# Altium schematic sheet Main.SchDoc
size A4; Organization: HTL Hollabrunn; Address1: Abteilung Elektronik; Address2: Anton Ehrenfried-Straße 10; Address3: 2020 Hollabrunn; SheetNumber: 1; SheetTotal: 1; SPICEModelCacheOAIEALSM: <root> / <DocumentId>OAIEALSM</DocumentId> / <CacheFrame Number="0"> / <Model Name="cap" Kind="MDL"> / <Text>*Default semiconductor capacitor / .MODEL CAP C()</Text> / </Model> / </CacheFrame> / </root>
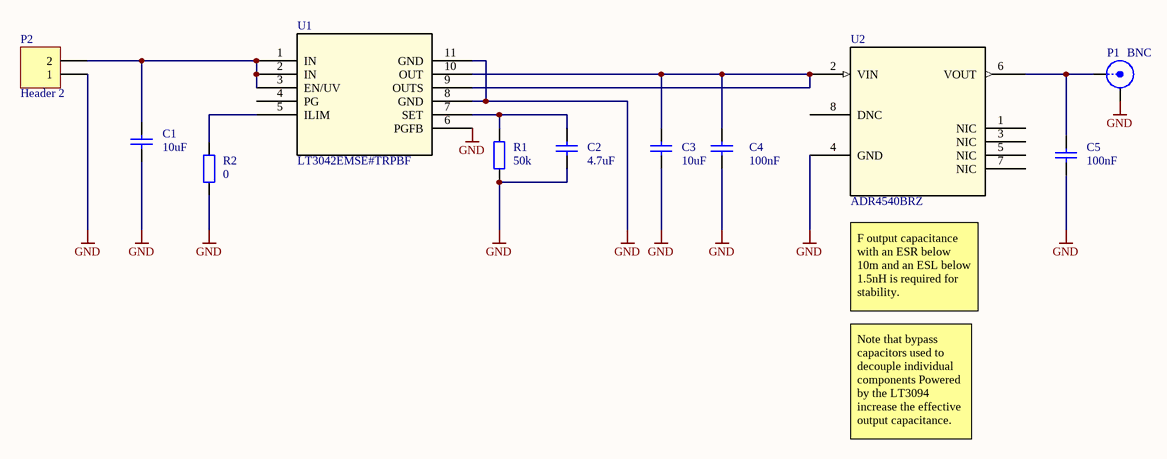
[diagram p0: Main.SchDoc]

## Parts
C1  10uF  [C1206-KUE]
C2  4.7uF  [C1206-KUE]
C3  10uF  [C1206-KUE]
C4  100nF  [C1206-KUE]
C5  100nF  [C1206-KUE]
P1  BNC  [BNC_RA CON]
P2  Header 2  [HDR1X2]
R1  50k  [C1206-KUE]
R2  0  [C1206-KUE]
U1  LT3042EMSE#TRPBF  [05-08-1664_ADI]
U2  ADR4540BRZ  [R-8_ADI]

## Nets
GND: C1.1 C2.1 C3.1 C4.1 C5.1 P1.2(Y) P2.1 R1.2 R2.2 U1.6(PGFB) U1.8(GND) U1.11(GND) U2.4(GND)
NetC1_2: C1.2 P2.2 U1.1(IN) U1.2(IN) U1.3(EN/UV)
NetC2_2: C2.2 R1.1 U1.7(SET)
NetC3_2: C3.2 C4.2 U1.9(OUTS) U1.10(OUT) U2.2(VIN)
NetC5_2: C5.2 P1.1(X) U2.6(VOUT)
NetR2_1: R2.1 U1.5(ILIM)

Not connected (* = marked no-connect by the designer): U1 4(PG); U2 1(NIC) 3(NIC) 5(NIC) 7(NIC) 8(DNC)

## Notes on the sheet
- F output capacitance with an ESR below 10m and an ESL below 1.5nH is required for stability.
- Note that bypass capacitors used to decouple individual components Powered by the LT3094 increase the effective output capacitance.
- Title
- Size:
- Date:
- A4
- Number:
- Time:
- Revision:
- Sheet
- of
- HTL Hollabrunn
- Abteilung Elektronik
- Anton Ehrenfried-Straße 10
- 2020 Hollabrunn
- File:
- Drawn By:

## Library data of the parts
C1 = Capacitor: Manufacturer: Kemet; Bezeichnung: Kerko +-10% 63V; Published: 8-Jun-2000; LatestRevisionDate: 17-Jul-2002; LatestRevisionNote: Re-released for DXP Platform.; PackageReference: RAD-0.3; Publisher: Altium Limited; PackageDescription: Radial Cap, Thru-Hole; 2 Leads; 0.3 in Pin Spacing; Value: 10uF; Orderingcode: *
C2-C4 = Capacitor: Capacitor X7R; Manufacturer: Kemet; Bezeichnung: Kerko +-10% 63V; Published: 8-Jun-2000; LatestRevisionDate: 17-Jul-2002; LatestRevisionNote: Re-released for DXP Platform.; PackageReference: RAD-0.3; Publisher: Altium Limited; PackageDescription: Radial Cap, Thru-Hole; 2 Leads; 0.3 in Pin Spacing; Orderingcode: *
  C2: Value: 4.7uF
  C3: Value: 10uF
  C4: Value: 100nF
C5 = Capacitor: Capacitor X7r; Manufacturer: Kemet; Bezeichnung: Kerko +-10% 63V; Published: 8-Jun-2000; LatestRevisionDate: 17-Jul-2002; LatestRevisionNote: Re-released for DXP Platform.; PackageReference: RAD-0.3; Publisher: Altium Limited; PackageDescription: Radial Cap, Thru-Hole; 2 Leads; 0.3 in Pin Spacing; Value: 100nF; Orderingcode: *
P1 = BNC: BNC Elbow Connector; LatestRevisionDate: 17-Jul-2002; LatestRevisionNote: Re-released for DXP Platform.; Publisher: Altium Limited
P2 = Header 2: Header, 2-Pin; LatestRevisionDate: 17-Jul-2002; LatestRevisionNote: Re-released for DXP Platform.; Publisher: Altium Limited
R1 = ResistorSMD: Resistor SMD 1%; Manufacturer: AVX; Bezeichnung: SMD Wid. 1/8W 2%; Published: 8-Jun-2000; LatestRevisionDate: 17-Jul-2002; LatestRevisionNote: Re-released for DXP Platform.; PackageReference: AXIAL-0.4; Publisher: Altium Limited; PackageDescription: Axial Device, Thru-Hole; 2 Leads; 0.4 in Pin Spacing; Value: 50k; Orderingcode: *
R2 = ResistorSMD: Resistor SMD; Manufacturer: AVX; Bezeichnung: SMD Wid. 1/8W 2%; Published: 8-Jun-2000; LatestRevisionDate: 17-Jul-2002; LatestRevisionNote: Re-released for DXP Platform.; PackageReference: AXIAL-0.4; Publisher: Altium Limited; PackageDescription: Axial Device, Thru-Hole; 2 Leads; 0.4 in Pin Spacing; Value: 0; Orderingcode: *
U1 = LT3042EMSETRPBF: 20V, 200mA, Ultralow Noise, Ultrahigh PSRR RF Linear Regulator; Manufacturer_Name: Analog Devices Inc; Type: Power Management; Copyright: Copyright (C) 2025 Ultra Librarian. All rights reserved.; Manufacturer_Part_Number: LT3042EMSE#TRPBF; RefDes: RefDes
U2 = ADR4540BRZ: Ultra-Low-Noise, High-Accuracy 4.096V Voltage Reference; Manufacturer_Name: Analog Devices Inc; Type: Power Management; Copyright: Copyright (C) 2025 Ultra Librarian. All rights reserved.; Manufacturer_Part_Number: ADR4540BRZ; RefDes: RefDes